# Altium schematic sheet top.SchDoc
size A; SheetNumber: 1; SheetTotal: 3
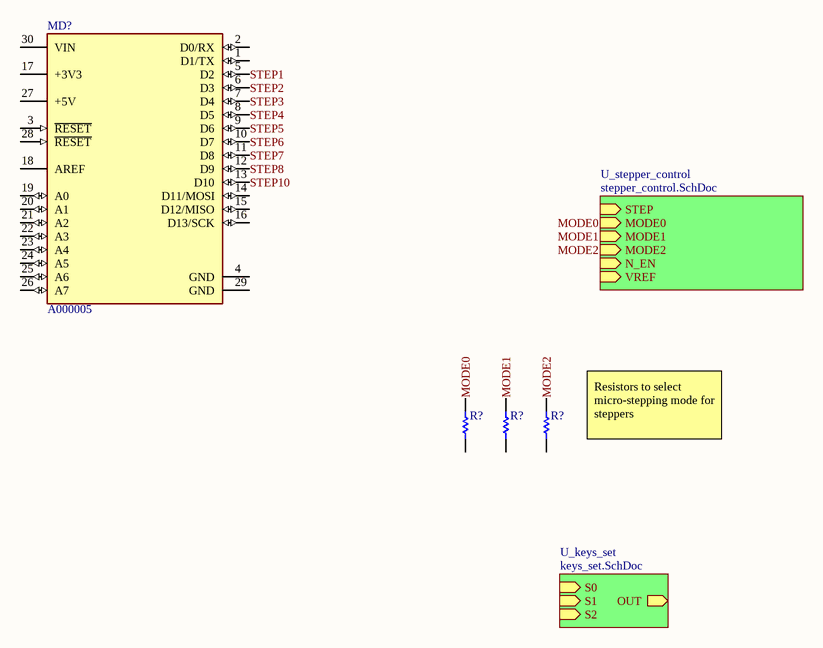
[diagram p0: top.SchDoc]

## Parts
(Parts that share a designator on the sheet are numbered #1, #2 ... from top to bottom, then left to right.)
MD?  A000005  [FP-A000005-MFG]
R?#1  RC0603JR-070RL  [RESC1608X55X25ML10T15]  (value not drawn)
R?#2  RC0603JR-070RL  [RESC1608X55X25ML10T15]  (value not drawn)
R?#3  RC0603JR-070RL  [RESC1608X55X25ML10T15]  (value not drawn)

## Sub-sheets
U_keys_set = keys_set.SchDoc: S0 (in), S1 (in), S2 (in), OUT (out)
U_stepper_control = stepper_control.SchDoc: STEP (in), MODE0 (in), MODE1 (in), MODE2 (in), N_EN (in), VREF (in)

## Nets
MODE0: R?#1.1 ; sheet U_stepper_control/MODE0
MODE1: R?#2.1 ; sheet U_stepper_control/MODE1
MODE2: R?#3.1 ; sheet U_stepper_control/MODE2
STEP1: MD?.5(D2)
STEP2: MD?.6(D3)
STEP3: MD?.7(D4)
STEP4: MD?.8(D5)
STEP5: MD?.9(D6)
STEP6: MD?.10(D7)
STEP7: MD?.11(D8)
STEP8: MD?.12(D9)
STEP10: MD?.13(D10)

Not connected (* = marked no-connect by the designer): MD? 1(D1/TX) 2(D0/RX) 3(~{RESET}) 4(GND) 14(D11/MOSI) 15(D12/MISO) 16(D13/SCK) 17(+3V3) 18(AREF) 19(A0) 20(A1) 21(A2) 22(A3) 23(A4) 24(A5) 25(A6) 26(A7) 27(+5V) 28(~{RESET}) 29(GND) 30(VIN); R?#1 2; R?#2 2; R?#3 2

## Notes on the sheet
- (near R?#3) Resistors to select micro-stepping mode for steppers

## Library data of the parts
MD? = CMP-189986-000002-1: ARDUINO NANO ATMEGA328 EVAL BRD; Number of Bits: 8; Evaluation Kit: Yes; Operating Supply Voltage: 12V; Interface: I2C; Data Bus Width: 8b; Core Architecture: AVR; Packaging: Bulk; Length: 7inch; Package Quantity: 50; Width: 5inch; REACH SVHC: No SVHC; Weight: 0.358383oz; Series: AVR® ATmega; Height: 0.25inch
R?#1-R?#3 = CMP-2100-03667-1: Chip Resistor, 0 Ohm, +/- 5%, 0.1 W, -55 to 155 degC, 0603 (1608 Metric), RoHS, Tape and Reel; Manufacturer: Yageo; Temperature Coefficient: 200ppm/degreesC; Voltage Rating: 50V; Power Rating: 100mW; Resistance: 0mOhm; Width: 0.8mm; Max Operating Temperature: 155degC; Tolerance: 5%; Package Reference: 0603; Height: 0.45mm; Depth: 0.8mm; Package Description: 2-Pin Surface Mount Device, Body 1.6 x 0.8 mm; Termination: SMD/SMT; Package Quantity: 5000; Case/Package: 0603; Case Code (Imperial): 0603; Radiation Hardening: No; Number of Pins: 2; Length: 1.6mm; Lead Free: LeadFree; Voltage Rating (DC): 50V; Military Standard: Not; Datasheet URL: http://www.yageo.com/NewPortal/yageodocoutput?fileName=/pdf/R-Chip/PYu-RC_Group_51_RoHS_L_5.pdf; Manufacturer URL: http://www.yageo.com/; Packaging: TapeandReel; Case Code (Metric): 1608; Min Operating Temperature: -55degC; Composition: ThickFilm; RoHSCompliant: true; Contact Plating: Tin; Datasheet Version: Rev. 5, 10/2016; REACH SVHC: NoSVHC